# EAGLE design baseboard (EAGLE 6.4)
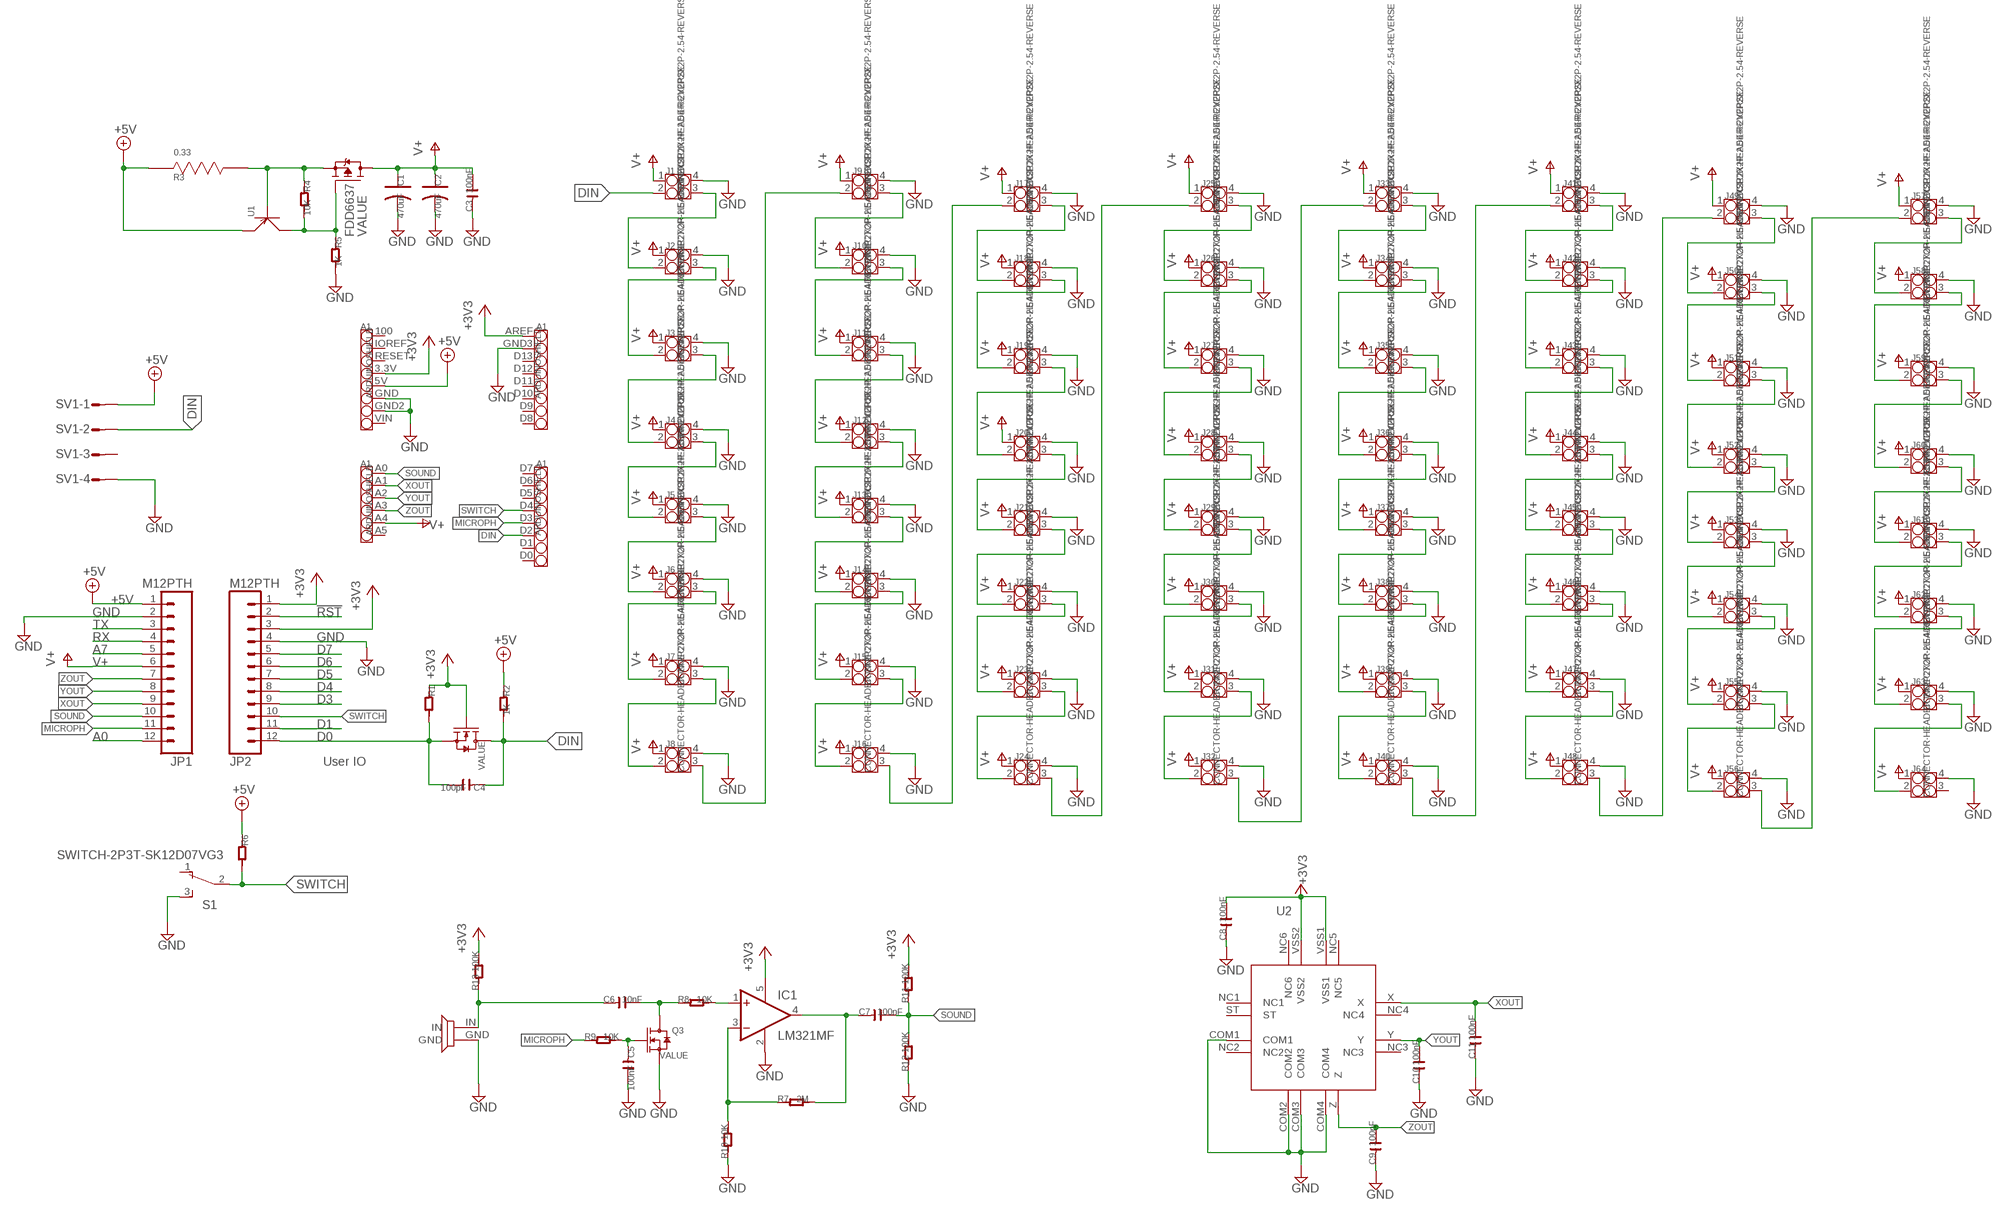
[diagram p0: schematic, sheet 1]

## Parts
2N7002  MOSFET-N-044020001  [SOT23]
A1  ARDUINOSHIELD  [ARDUINOSHIELD]
C1  470uF  C-POLARCAPACITOR-E5-8.5  [CAPACITOR-E5-8.5]
C2  470uF  C-POLARCAPACITOR-E5-8.5  [CAPACITOR-E5-8.5]
C3  100nF  C-0603  [C0603]
C4  100pF  C-0603  [C0603]
C5  100nF  C-0603  [C0603]
C6  10nF  C-0603  [C0603]
C7  100nF  C-0603  [C0603]
C8  100nF  C-0603  [C0603]
C9  100nF  C-0603  [C0603]
C10  100nF  C-0603  [C0603]
C11  100nF  C-0603  [C0603]
FDD6637  FDD4141TO252  [TO252]
IC1  LM321MF  [SOT23-5]
J1  CONNECTOR-HEADER-2X2P2X2P-2.54-REVERSE  [2X2P-2.54-REVERSE]
J2  CONNECTOR-HEADER-2X2P2X2P-2.54-REVERSE  [2X2P-2.54-REVERSE]
J3  CONNECTOR-HEADER-2X2P2X2P-2.54-REVERSE  [2X2P-2.54-REVERSE]
J4  CONNECTOR-HEADER-2X2P2X2P-2.54-REVERSE  [2X2P-2.54-REVERSE]
J5  CONNECTOR-HEADER-2X2P2X2P-2.54-REVERSE  [2X2P-2.54-REVERSE]
J6  CONNECTOR-HEADER-2X2P2X2P-2.54-REVERSE  [2X2P-2.54-REVERSE]
J7  CONNECTOR-HEADER-2X2P2X2P-2.54-REVERSE  [2X2P-2.54-REVERSE]
J8  CONNECTOR-HEADER-2X2P2X2P-2.54-REVERSE  [2X2P-2.54-REVERSE]
J9  CONNECTOR-HEADER-2X2P2X2P-2.54-REVERSE  [2X2P-2.54-REVERSE]
J10  CONNECTOR-HEADER-2X2P2X2P-2.54-REVERSE  [2X2P-2.54-REVERSE]
J11  CONNECTOR-HEADER-2X2P2X2P-2.54-REVERSE  [2X2P-2.54-REVERSE]
J12  CONNECTOR-HEADER-2X2P2X2P-2.54-REVERSE  [2X2P-2.54-REVERSE]
J13  CONNECTOR-HEADER-2X2P2X2P-2.54-REVERSE  [2X2P-2.54-REVERSE]
J14  CONNECTOR-HEADER-2X2P2X2P-2.54-REVERSE  [2X2P-2.54-REVERSE]
J15  CONNECTOR-HEADER-2X2P2X2P-2.54-REVERSE  [2X2P-2.54-REVERSE]
J16  CONNECTOR-HEADER-2X2P2X2P-2.54-REVERSE  [2X2P-2.54-REVERSE]
J17  CONNECTOR-HEADER-2X2P2X2P-2.54-REVERSE  [2X2P-2.54-REVERSE]
J18  CONNECTOR-HEADER-2X2P2X2P-2.54-REVERSE  [2X2P-2.54-REVERSE]
J19  CONNECTOR-HEADER-2X2P2X2P-2.54-REVERSE  [2X2P-2.54-REVERSE]
J20  CONNECTOR-HEADER-2X2P2X2P-2.54-REVERSE  [2X2P-2.54-REVERSE]
J21  CONNECTOR-HEADER-2X2P2X2P-2.54-REVERSE  [2X2P-2.54-REVERSE]
J22  CONNECTOR-HEADER-2X2P2X2P-2.54-REVERSE  [2X2P-2.54-REVERSE]
J23  CONNECTOR-HEADER-2X2P2X2P-2.54-REVERSE  [2X2P-2.54-REVERSE]
J24  CONNECTOR-HEADER-2X2P2X2P-2.54-REVERSE  [2X2P-2.54-REVERSE]
J25  CONNECTOR-HEADER-2X2P2X2P-2.54-REVERSE  [2X2P-2.54-REVERSE]
J26  CONNECTOR-HEADER-2X2P2X2P-2.54-REVERSE  [2X2P-2.54-REVERSE]
J27  CONNECTOR-HEADER-2X2P2X2P-2.54-REVERSE  [2X2P-2.54-REVERSE]
J28  CONNECTOR-HEADER-2X2P2X2P-2.54-REVERSE  [2X2P-2.54-REVERSE]
J29  CONNECTOR-HEADER-2X2P2X2P-2.54-REVERSE  [2X2P-2.54-REVERSE]
J30  CONNECTOR-HEADER-2X2P2X2P-2.54-REVERSE  [2X2P-2.54-REVERSE]
J31  CONNECTOR-HEADER-2X2P2X2P-2.54-REVERSE  [2X2P-2.54-REVERSE]
J32  CONNECTOR-HEADER-2X2P2X2P-2.54-REVERSE  [2X2P-2.54-REVERSE]
J33  CONNECTOR-HEADER-2X2P2X2P-2.54-REVERSE  [2X2P-2.54-REVERSE]
J34  CONNECTOR-HEADER-2X2P2X2P-2.54-REVERSE  [2X2P-2.54-REVERSE]
J35  CONNECTOR-HEADER-2X2P2X2P-2.54-REVERSE  [2X2P-2.54-REVERSE]
J36  CONNECTOR-HEADER-2X2P2X2P-2.54-REVERSE  [2X2P-2.54-REVERSE]
J37  CONNECTOR-HEADER-2X2P2X2P-2.54-REVERSE  [2X2P-2.54-REVERSE]
J38  CONNECTOR-HEADER-2X2P2X2P-2.54-REVERSE  [2X2P-2.54-REVERSE]
J39  CONNECTOR-HEADER-2X2P2X2P-2.54-REVERSE  [2X2P-2.54-REVERSE]
J40  CONNECTOR-HEADER-2X2P2X2P-2.54-REVERSE  [2X2P-2.54-REVERSE]
J41  CONNECTOR-HEADER-2X2P2X2P-2.54-REVERSE  [2X2P-2.54-REVERSE]
J42  CONNECTOR-HEADER-2X2P2X2P-2.54-REVERSE  [2X2P-2.54-REVERSE]
J43  CONNECTOR-HEADER-2X2P2X2P-2.54-REVERSE  [2X2P-2.54-REVERSE]
J44  CONNECTOR-HEADER-2X2P2X2P-2.54-REVERSE  [2X2P-2.54-REVERSE]
J45  CONNECTOR-HEADER-2X2P2X2P-2.54-REVERSE  [2X2P-2.54-REVERSE]
J46  CONNECTOR-HEADER-2X2P2X2P-2.54-REVERSE  [2X2P-2.54-REVERSE]
J47  CONNECTOR-HEADER-2X2P2X2P-2.54-REVERSE  [2X2P-2.54-REVERSE]
J48  CONNECTOR-HEADER-2X2P2X2P-2.54-REVERSE  [2X2P-2.54-REVERSE]
J49  CONNECTOR-HEADER-2X2P2X2P-2.54-REVERSE  [2X2P-2.54-REVERSE]
J50  CONNECTOR-HEADER-2X2P2X2P-2.54-REVERSE  [2X2P-2.54-REVERSE]
J51  CONNECTOR-HEADER-2X2P2X2P-2.54-REVERSE  [2X2P-2.54-REVERSE]
J52  CONNECTOR-HEADER-2X2P2X2P-2.54-REVERSE  [2X2P-2.54-REVERSE]
J53  CONNECTOR-HEADER-2X2P2X2P-2.54-REVERSE  [2X2P-2.54-REVERSE]
J54  CONNECTOR-HEADER-2X2P2X2P-2.54-REVERSE  [2X2P-2.54-REVERSE]
J55  CONNECTOR-HEADER-2X2P2X2P-2.54-REVERSE  [2X2P-2.54-REVERSE]
J56  CONNECTOR-HEADER-2X2P2X2P-2.54-REVERSE  [2X2P-2.54-REVERSE]
J57  CONNECTOR-HEADER-2X2P2X2P-2.54-REVERSE  [2X2P-2.54-REVERSE]
J58  CONNECTOR-HEADER-2X2P2X2P-2.54-REVERSE  [2X2P-2.54-REVERSE]
J59  CONNECTOR-HEADER-2X2P2X2P-2.54-REVERSE  [2X2P-2.54-REVERSE]
J60  CONNECTOR-HEADER-2X2P2X2P-2.54-REVERSE  [2X2P-2.54-REVERSE]
J61  CONNECTOR-HEADER-2X2P2X2P-2.54-REVERSE  [2X2P-2.54-REVERSE]
J62  CONNECTOR-HEADER-2X2P2X2P-2.54-REVERSE  [2X2P-2.54-REVERSE]
J63  CONNECTOR-HEADER-2X2P2X2P-2.54-REVERSE  [2X2P-2.54-REVERSE]
J64  CONNECTOR-HEADER-2X2P2X2P-2.54-REVERSE  [2X2P-2.54-REVERSE]
JP1  M12PTH  [1X12-SMALL-PADS]
JP2  M12PTH  [1X12-SMALL-PADS]
Q3  MOSFET-N-044020001  [SOT23]
R1  R-0603  [R0603]
R2  1K  R-0603  [R0603]
R3  0.33  RESISTOR-3W-20MM  [RESISTOR-3W-20MM]
R4  10K  R-0603  [R0603]
R5  1K  R-0603  [R0603]
R6  R-0603  [R0603]
R7  2M  R-0603  [R0603]
R8  10K  R-0603  [R0603]
R9  10K  R-0603  [R0603]
R10  10K  R-0603  [R0603]
R11  100K  R-0603  [R0603]
R12  100K  R-0603  [R0603]
R13  100K  R-0603  [R0603]
S1  SWITCH-2P3T-SK12D07VG3  [SWITCH-2P3T-SK12D07VG3]
SV1  S04P  [S04P]
U1  TRANSISTOR-PNP-041003001  [SOT23]
U2  ADXL335  [ADXL335]
U$1  MICROPHONE  [MICROPHONE]

## Nets
!RST: JP2.2
+3V3: 2N7002.1(G) A1.3.3V A1.AREF C8.2 IC1.5(V+) JP2.1 JP2.3 R1.1 R11.2 R13.2 U2.VSS1 U2.VSS2
+5V: A1.5V JP1.1 R2.1 R3.1 R6.1 SV1.1 U1.2(E)
A0: JP1.12
A7: JP1.5
D0: 2N7002.2(S) C4.2 JP2.12 R1.2
D1: JP2.11
D3: JP2.9
D4: JP2.8
D5: JP2.7
D6: JP2.6
D7: JP2.5
DIN: 2N7002.3(D) A1.D2 C4.1 J1.2 R2.2 SV1.2
GND: A1.GND A1.GND2 A1.GND3 C1.- C2.- C3.1 C5.2 C8.1 C9.1 C10.1 C11.1 IC1.2(V-) J1.4 J2.4 J3.4 J4.4 J5.4 J6.4 J7.4 J8.4 J9.4 J10.4 J11.4 J12.4 J13.4 J14.4 J15.4 J16.4 J17.4 J18.4 J19.4 J20.4 J21.4 J22.4 J23.4 J24.4 J25.4 J26.4 J27.4 J28.4 J29.4 J30.4 J31.4 J32.4 J33.4 J34.4 J35.4 J36.4 J37.4 J38.4 J39.4 J40.4 J41.4 J42.4 J43.4 J44.4 J45.4 J46.4 J47.4 J48.4 J49.4 J50.4 J51.4 J52.4 J53.4 J54.4 J55.4 J56.4 J57.4 J58.4 J59.4 J60.4 J61.4 J62.4 J63.4 J64.4 JP1.2 JP2.4 Q3.2(S) R5.2 R10.1 R12.1 S1.3(S) SV1.4 U2.COM1 U2.COM2 U2.COM3 U2.COM4 U$1.GND
MICROPH: A1.D3 JP1.11 R9.1
N$1: J1.3 J2.2
N$2: J2.3 J3.2
N$3: J3.3 J4.2
N$4: J5.3 J6.2
N$5: J6.3 J7.2
N$6: J7.3 J8.2
N$7: J4.3 J5.2
N$8: J9.3 J10.2
N$9: J10.3 J11.2
N$10: J11.3 J12.2
N$11: J13.3 J14.2
N$12: J14.3 J15.2
N$13: J15.3 J16.2
N$14: J12.3 J13.2
N$15: J17.3 J18.2
N$16: J18.3 J19.2
N$17: J19.3 J20.2
N$18: J21.3 J22.2
N$19: J22.3 J23.2
N$20: J23.3 J24.2
N$21: J20.3 J21.2
N$22: J25.3 J26.2
N$23: J26.3 J27.2
N$24: J27.3 J28.2
N$25: J29.3 J30.2
N$26: J30.3 J31.2
N$27: J31.3 J32.2
N$28: J28.3 J29.2
N$29: J8.3 J9.2
N$30: J16.3 J17.2
N$31: J24.3 J25.2
N$32: C7.1 IC1.4(OUT) R7.2
N$33: J33.3 J34.2
N$34: J34.3 J35.2
N$35: J35.3 J36.2
N$36: J37.3 J38.2
N$37: J38.3 J39.2
N$38: J39.3 J40.2
N$39: J36.3 J37.2
N$40: J41.3 J42.2
N$41: J42.3 J43.2
N$42: J43.3 J44.2
N$43: J45.3 J46.2
N$44: J46.3 J47.2
N$45: J47.3 J48.2
N$46: J44.3 J45.2
N$47: J49.3 J50.2
N$48: J50.3 J51.2
N$49: J51.3 J52.2
N$50: J53.3 J54.2
N$51: J54.3 J55.2
N$52: J55.3 J56.2
N$53: J52.3 J53.2
N$54: J57.3 J58.2
N$55: J58.3 J59.2
N$56: J59.3 J60.2
N$57: J61.3 J62.2
N$58: J62.3 J63.2
N$59: J63.3 J64.2
N$60: J60.3 J61.2
N$61: J40.3 J41.2
N$62: J48.3 J49.2
N$63: J56.3 J57.2
N$64: J32.3 J33.2
N$65: FDD6637.2(S) R3.2 R4.1 U1.1(B)
N$66: IC1.3(-IN) R7.1 R10.2
N$67: FDD6637.1(G) R4.2 R5.1 U1.3(C)
N$68: C5.1 Q3.1(G) R9.2
N$69: IC1.1(+IN) R8.2
N$70: C6.2 Q3.3(D) R8.1
N$72: C6.1 R13.1 U$1.IN
RX: JP1.4
SOUND: A1.A0 C7.2 JP1.10 R11.1 R12.2
SWITCH: A1.D4 JP2.10 R6.2 S1.2(P)
TX: JP1.3
V+: A1.A4 C1.+ C2.+ C3.2 FDD6637.3(D) J1.1 J2.1 J3.1 J4.1 J5.1 J6.1 J7.1 J8.1 J9.1 J10.1 J11.1 J12.1 J13.1 J14.1 J15.1 J16.1 J17.1 J18.1 J19.1 J20.1 J21.1 J22.1 J23.1 J24.1 J25.1 J26.1 J27.1 J28.1 J29.1 J30.1 J31.1 J32.1 J33.1 J34.1 J35.1 J36.1 J37.1 J38.1 J39.1 J40.1 J41.1 J42.1 J43.1 J44.1 J45.1 J46.1 J47.1 J48.1 J49.1 J50.1 J51.1 J52.1 J53.1 J54.1 J55.1 J56.1 J57.1 J58.1 J59.1 J60.1 J61.1 J62.1 J63.1 J64.1 JP1.6
XOUT: A1.A1 C11.2 JP1.9 U2.X
YOUT: A1.A2 C10.2 JP1.8 U2.Y
ZOUT: A1.A3 C9.2 JP1.7 U2.Z
Unconnected: A1.100 A1.A5 A1.D0 A1.D1 A1.D5 A1.D6 A1.D7 A1.D8 A1.D9 A1.D10 A1.D11 A1.D12 A1.D13 A1.IOREF A1.RESET A1.VIN J64.3 S1.1(O) SV1.3 U2.NC1 U2.NC2 U2.NC3 U2.NC4 U2.NC5 U2.NC6 U2.ST

## Notes on the sheet
- User IO

## Library data of the parts
2N7002 Q3 = OPL Eagle Library:MOSFET-N: CJ2302：SMD MOSFET N-CH 20V-2.1A
A1 = OPL Eagle Library:ARDUINOSHIELD
C1 C2 = OPL Eagle Library:C-POLAR*
C3-C11 = OPL Eagle Library:C*
FDD6637 = transistor-fet:FDD4141: P-Channel PowerTrench® MOSFET Source: FDD4141.pdf
IC1 = linear:LM321?*: Low Power Single Op Amp Source: http://cache.national.com/ds/LM/LM321.pdf
J1-J64 = OPL Eagle Library:CONNECTOR-HEADER-2X2P
JP1 JP2 = Spark:M12: Header 12 Standard 12-pin 0.1" header. Use with straight break away headers (SKU : PRT-00116), right angle break away headers (PRT-00553), swiss pins (PRT-00743), machine pins (PRT-00117), and female headers (PRT-00115).
R1 R2 R4-R13 = OPL Eagle Library:R*
R3 = OPL Eagle Library:RESISTOR-3W-20MM
S1 = OPL Eagle Library:SWITCH-2P3T-SK12D07VG3: TINY SWITCH ON - ON Source: http://www2.produktinfo.conrad.com/datenblaetter/700000-724999/705152-da-01-de-Subminiaturschalter_TL_36YO.pdf
SV1 = con-amp-mt:S04P: AMP MT CONNECTOR; OC_FARNELL: unknown; OC_NEWARK: unknown
U1 = OPL Eagle Library:TRANSISTOR-PNP*: S8550：PNP Transistor
U2 = OPL Eagle Library:ADXL335
U$1 = OPL Eagle Library:MICROPHONE

## Board
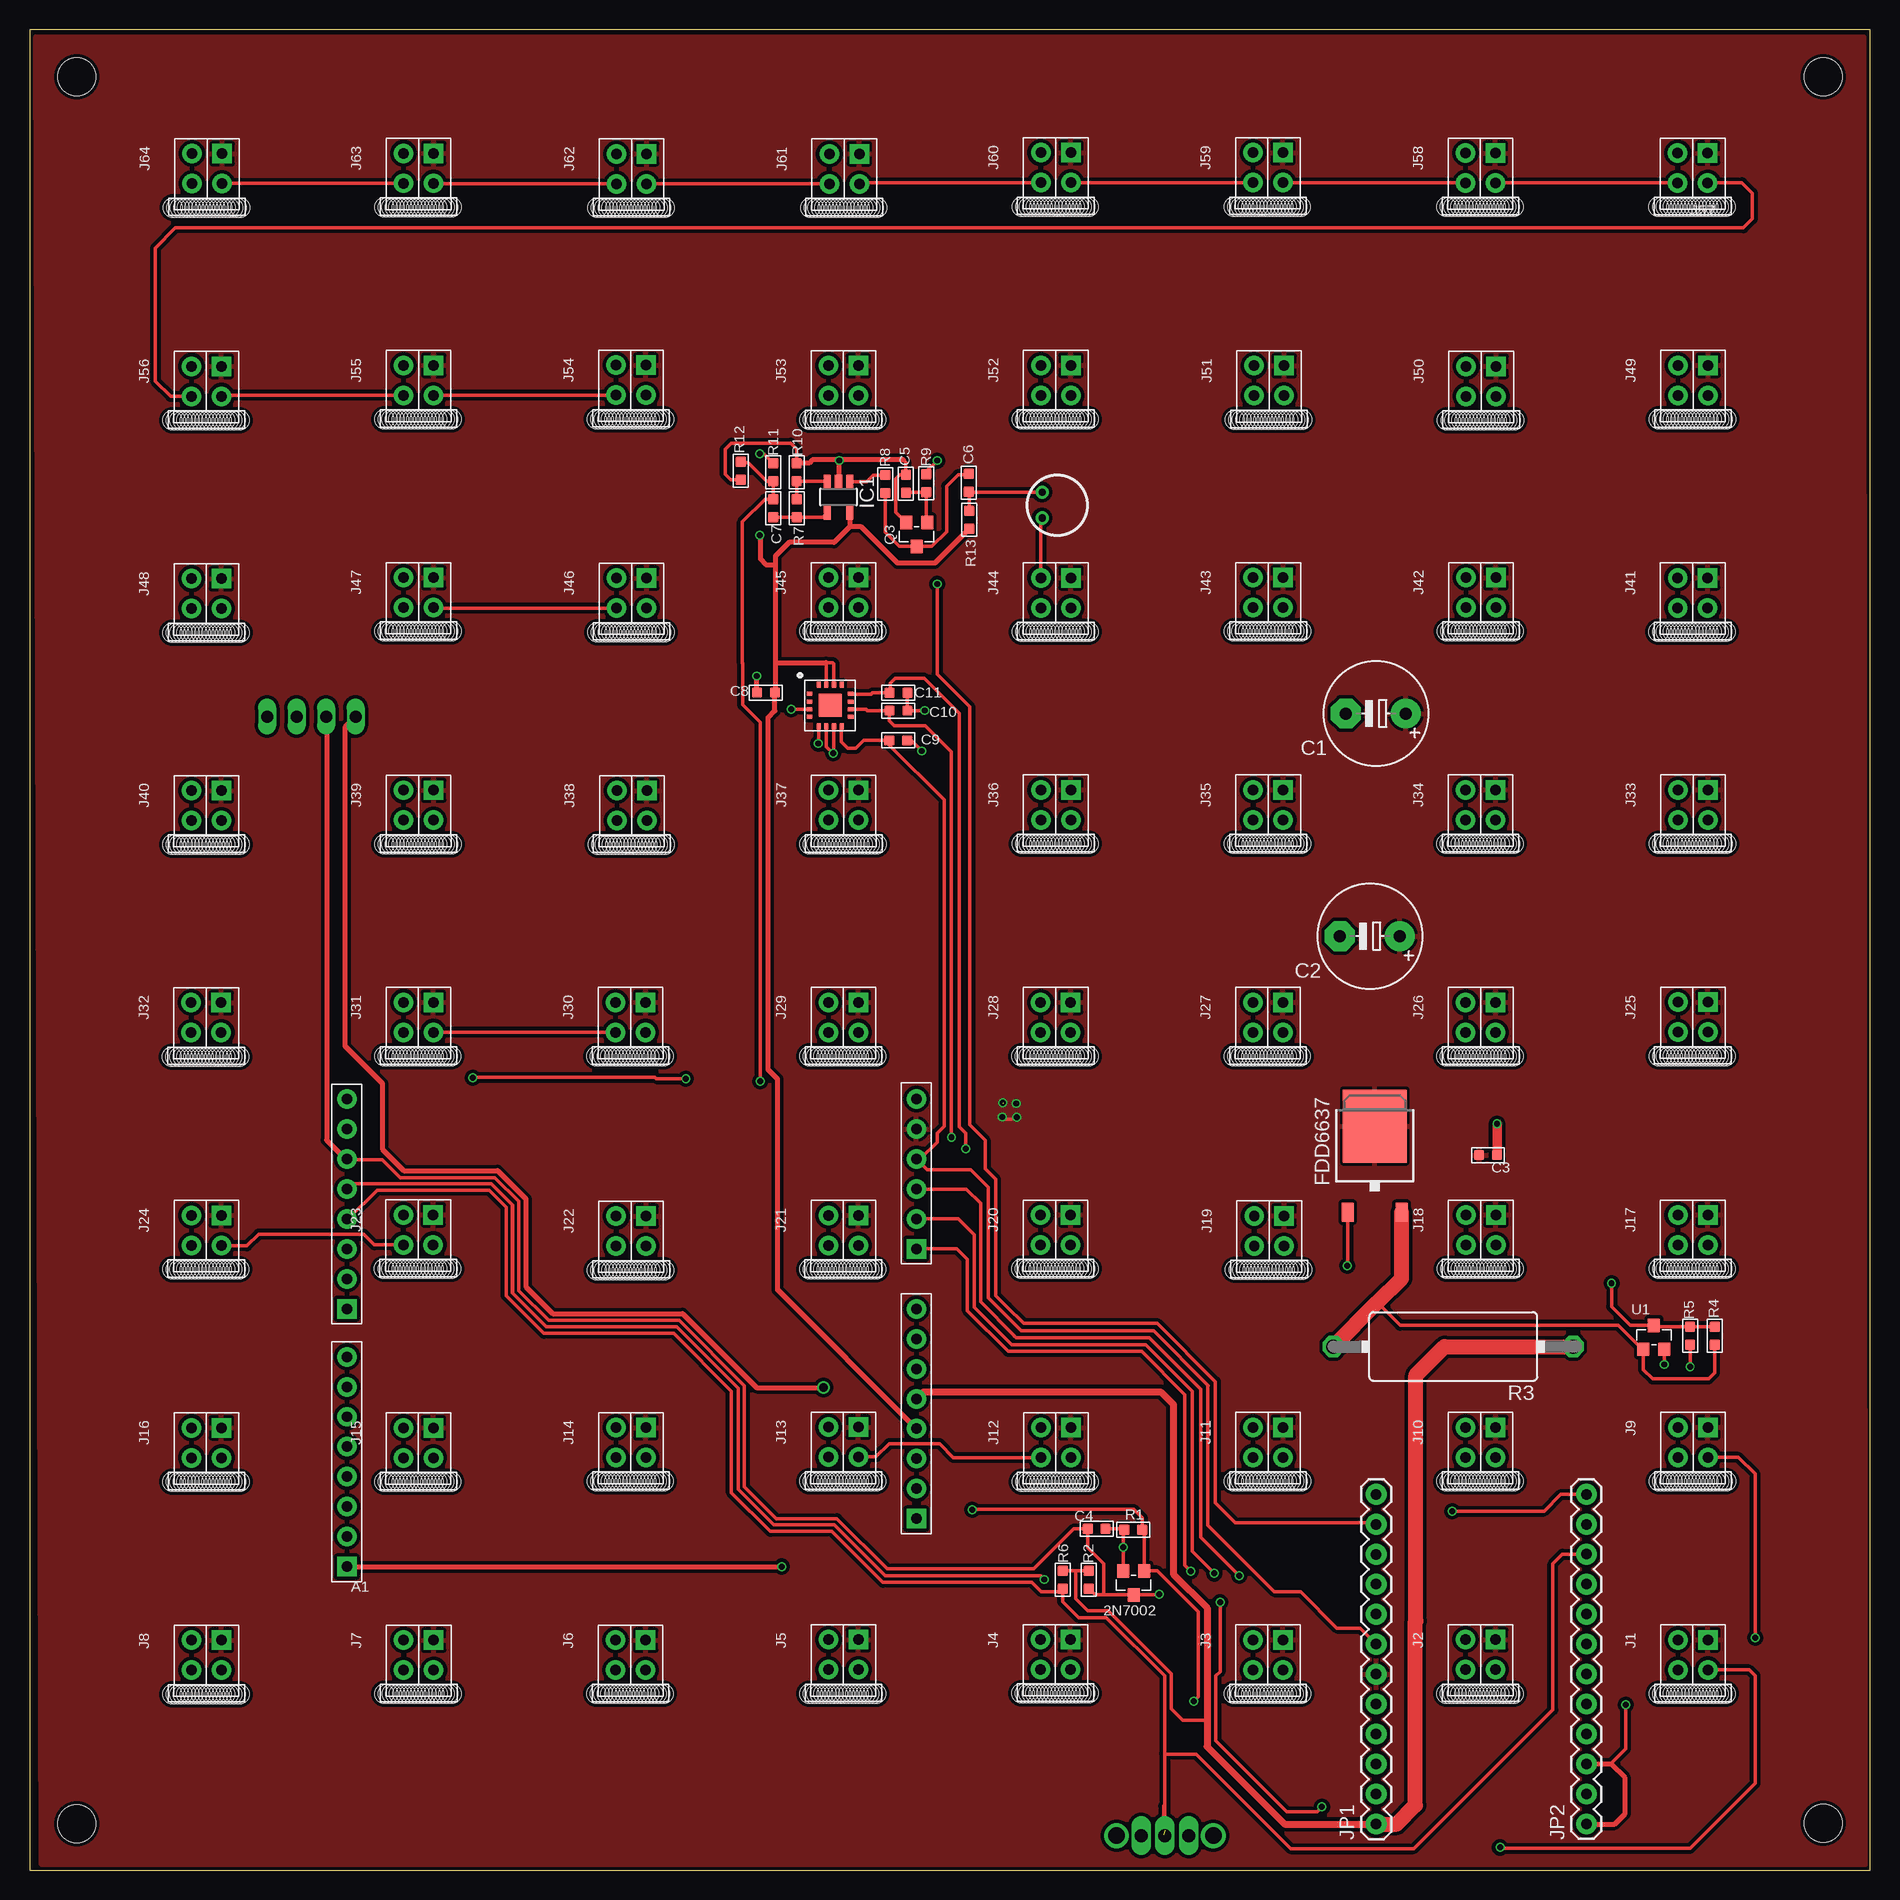
[diagram p1: board, top side]
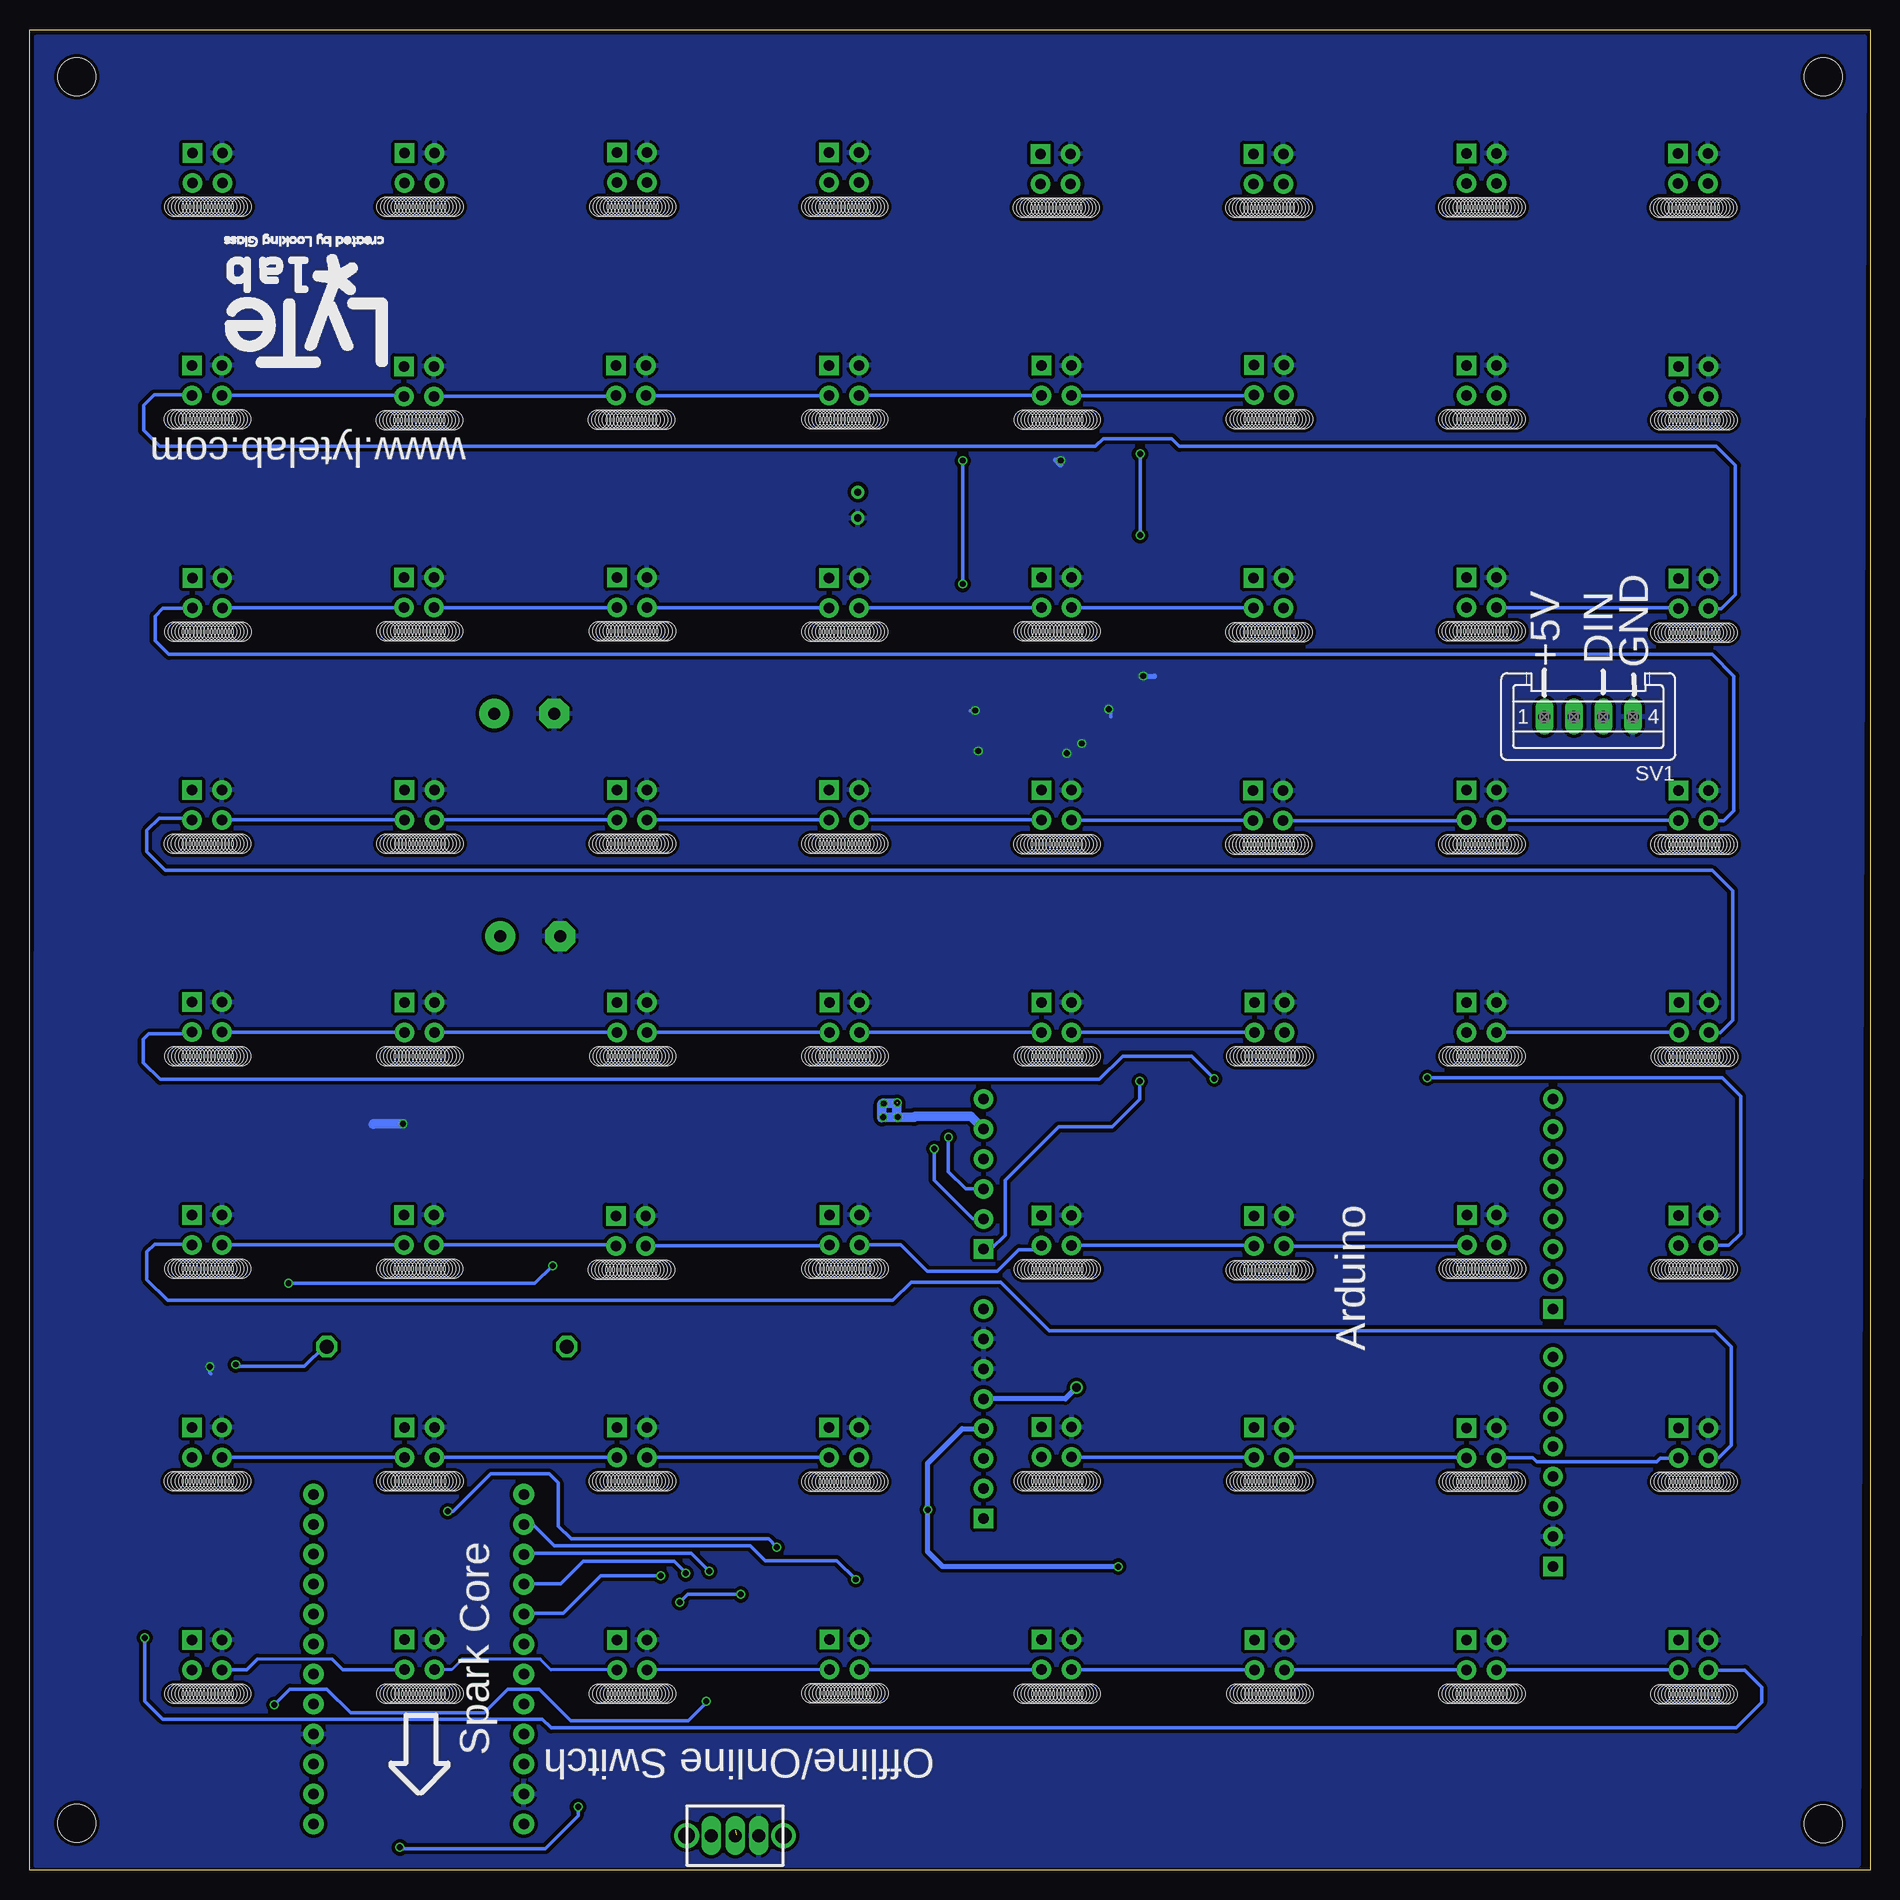
[diagram p2: board, bottom side, seen from below]

Size 156.01 x 156.01 mm. Coordinates in mm from the lower left corner, seen from the top.
Outline: 156.01,156.01 0,156.01 0,0 156.01,0 156.01,156.01
Copper layers (1*16): Top 0.035mm / dielectric 0.5mm / Bottom 0.035mm
Design rules "default *": minimum track width 10mil, minimum drill 15mil, track to track 8mil, track to pad 0mil, pad to pad 0mil, via to via 0mil, smd to smd 8mil, copper to edge 0mil, drill to drill 0mil, minimum pad ring 10mil, minimum via ring 0mil, stop-mask expansion 4mil, vias tented up to drill 0mil, thermal gap 10mil
Holes 3.2 mm at 3.99,151.99 152.02,151.99 152.02,3.99 3.99,3.96

### Footprints (pad centres in the part's own frame; a part is rotated, then mirrored left to right if it is on the bottom)
SOT23 = smd 1.016 x 1.143: 1 -0.889,-1.016; 2 0.889,-1.016; 3 0,1.016
ARDUINOSHIELD = drill 0.889 pad 1.651: 3.3V 35.56,2.54; 5V 38.1,2.54; A1 53.34,2.54; A2 55.88,2.54; A3 58.42,2.54; A4 60.96,2.54; A5 63.5,2.54; D0 63.5,50.8; D1 60.96,50.8; D2 58.42,50.8; D3 55.88,50.8; D4 53.34,50.8; D5 50.8,50.8; D6 48.26,50.8; D8 41.656,50.8; D9 39.116,50.8; D10 36.576,50.8; D11 34.036,50.8; D12 31.496,50.8; D13 28.956,50.8; GND 40.64,2.54; GND2 43.18,2.54; GND3 26.416,50.8; IOREF 30.48,2.54; RESET 33.02,2.54; VIN 45.72,2.54 | drill 0.889 pad 1.651 square: 100 27.94,2.54; A0 50.8,2.54; AREF 23.876,50.8; D7 45.72,50.8
CAPACITOR-E5-8.5 = drill 1.016 pad 2.54: + -2.54,0 | drill 1.016 pad 2.54 octagon: - 2.54,0
C0603 = smd 0.889 x 0.889: 1 -0.762,0; 2 0.762,0
TO252 = smd 1 x 1.6: 1 -2.28,-4.8; 2 2.28,-4.8 | smd 5.4 x 6.2: 3 0,2.5
SOT23-5 = smd 0.6 x 1.2: 1 -0.95,-1.306; 2 0,-1.306; 3 0.95,-1.306; 4 0.95,1.306; 5 -0.95,1.306
2X2P-2.54-REVERSE = drill 0.889 pad 1.651 square: 1 -1.27,-1.27 | drill 0.889 pad 1.651: 2 -1.27,1.27; 3 1.27,1.27; 4 1.27,-1.27 | hole 1.6: -2.8,3.3; -2.5,3.3; -2.2,3.3; -1.9,3.3; -1.6,3.3; -1.3,3.3; -1,3.3; -0.7,3.3; -0.4,3.3; -0.1,3.3; 0.2,3.3; 0.5,3.3; 0.8,3.3; 1.1,3.3; 1.4,3.3; 1.7,3.3; 2,3.3; 2.3,3.3; 2.6,3.3; 2.9,3.3
1X12-SMALL-PADS = drill 0.889 pad 1.753: 1 0,0; 2 2.54,0; 3 5.08,0; 4 7.62,0; 5 10.16,0; 6 12.7,0; 7 15.24,0; 8 17.78,0; 9 20.32,0; 10 22.86,0; 11 25.4,0; 12 27.94,0
R0603 = smd 0.889 x 0.889: 1 -0.762,0; 2 0.762,0
RESISTOR-3W-20MM = drill 1.194 octagon: 1 -10.16,0; 2 10.16,0
SWITCH-2P3T-SK12D07VG3 = drill 1.1 pad 1.422 long: 1 -2,0; 2 0,0; 3 2,0 | drill 1.4 pad 1.93: M1 -4.1,0; M2 4.1,0
S04P = drill 1.016 long: 1 3.75,0; 2 1.25,0; 3 -1.25,0; 4 -3.75,0
ADXL335 = smd 0.5 x 0.35: COM1 -1.75,-0.325; NC1 -1.75,0.975; NC2 -1.75,-0.975; NC3 1.75,-0.975; NC4 1.75,0.325; ST -1.75,0.325; X 1.75,0.975; Y 1.75,-0.325 | smd 0.35 x 0.5: COM2 -0.975,-1.75; COM3 -0.325,-1.75; COM4 0.325,-1.75; NC5 0.975,1.75; NC6 -0.975,1.75; VSS1 0.325,1.75; VSS2 -0.325,1.75; Z 0.975,-1.75 | smd 1.95 x 1.95: P$17 0,0
MICROPHONE = drill 0.6: GND 0,-1.1; IN 0,1.1

### Placement (x,y rotation side)
2N7002  93.56,24.37 180 top
A1  77.7,1.87 90 top
C1  114.1,98.04 180 top
C2  113.59,79.17 180 top
C3  123.59,60.63 180 top
C4  90.42,28.96 0 top
C5  74.27,117.52 90 top
C6  79.58,117.59 90 top
C7  63.03,115.43 90 top
C8  62.41,99.82 0 top
C9  73.61,95.76 180 top
C10  73.63,98.3 180 top
C11  73.63,99.8 180 top
FDD6637  114,60.58 0 top
IC1  68.55,116.38 180 top
J1  140.96,18.28 180 top
J2  122.96,18.29 180 top
J3  104.95,18.27 180 top
J4  86.94,18.3 180 top
J5  68.97,18.29 180 top
J6  50.94,18.26 180 top
J7  32.98,18.26 180 top
J8  14.99,18.25 180 top
J9  140.97,36.28 180 top
J10  122.96,36.28 180 top
J11  104.95,36.28 180 top
J12  86.97,36.26 180 top
J13  68.97,36.29 180 top
J14  50.96,36.27 180 top
J15  32.95,36.24 180 top
J16  15,36.24 180 top
J17  140.95,54.28 180 top
J18  122.99,54.28 180 top
J19  105.06,54.2 180 top
J20  86.95,54.28 180 top
J21  68.97,54.25 180 top
J22  50.98,54.18 180 top
J23  32.94,54.29 180 top
J24  14.99,54.24 180 top
J25  140.95,72.31 180 top
J26  122.97,72.29 180 top
J27  104.94,72.29 180 top
J28  86.96,72.29 180 top
J29  68.97,72.3 180 top
J30  50.94,72.3 180 top
J31  32.95,72.3 180 top
J32  14.97,72.27 180 top
J33  140.97,90.3 180 top
J34  122.97,90.3 180 top
J35  104.97,90.3 180 top
J36  86.97,90.3 180 top
J37  68.99,90.27 180 top
J38  51.04,90.25 180 top
J39  32.97,90.27 180 top
J40  14.99,90.25 180 top
J41  140.94,108.27 180 top
J42  122.99,108.3 180 top
J43  104.97,108.3 180 top
J44  86.97,108.27 180 top
J45  68.97,108.3 180 top
J46  51.02,108.25 180 top
J47  32.97,108.3 180 top
J48  14.99,108.19 180 top
J49  140.97,126.27 180 top
J50  123.02,126.19 180 top
J51  105.04,126.25 180 top
J52  86.97,126.27 180 top
J53  68.97,126.25 180 top
J54  50.97,126.3 180 top
J55  32.97,126.27 180 top
J56  14.99,126.19 180 top
J57  140.94,144.27 180 top
J58  122.95,144.27 180 top
J59  104.94,144.3 180 top
J60  86.97,144.3 180 top
J61  69.04,144.19 180 top
J62  51.02,144.19 180 top
J63  32.97,144.25 180 top
J64  15.04,144.22 180 top
JP1  114.12,3.94 90 top
JP2  131.94,3.94 90 top
Q3  75.17,113.21 180 top
R1  93.54,28.89 180 top
R2  89.76,24.65 270 top
R3  120.65,44.4 180 top
R4  142.8,45.31 90 top
R5  140.72,45.31 270 top
R6  87.55,24.64 270 top
R7  65.01,115.45 270 top
R8  72.51,117.49 90 top
R9  76,117.56 270 top
R10  65,118.47 270 top
R11  63.03,118.48 90 top
R12  60.26,118.61 90 top
R13  79.63,114.46 270 top
S1  96.22,2.95 0 bottom
SV1  23.88,97.78 180 bottom
U1  137.64,45.19 0 top
U2  67.84,98.73 0 top
U$1  85.81,115.71 0 top

### Tracks (layer width: path | path; a pad name or v marks a point on that pad's centre or on a via)
+3V3  (via drill 0.5, 0.51)
  Top 0.305: C8.2 63.2,99.85 | U2.VSS1 68.17,102.27 68.07,102.36 67.51,102.36 U2.VSS2 | IC1.5 69.49,115.07 | R11.2 62.23,120.04 v61.9,120.04 | v61.9,113.16 61.92,113.13 | A1.3.3V 75.38,37.21 | v79.9,30.58 79.92,30.61 93.57,30.61 94.3,29.88 R1.1 94.45,28.74 2N7002.1 95.57,25.39 99.03,21.92 99.03,14.73 v98.65,14.35 | JP2.3 132.01,9.09 134.04,9.09 135.25,10.31 v135.25,14.05
  Top 0.406: 63.2,102.36 67.51,102.36 | 69.49,115.07 69.49,113.87 | 69.49,113.87 68.17,112.55 64.36,112.55 63.2,111.38 63.2,110.67 | 63.2,110.67 63.2,102.36 | 63.2,102.36 63.2,99.85 | 61.92,113.13 61.92,111.15 62.41,110.67 63.2,110.67 | R13.2 76.73,110.8 73.56,110.8 70.48,113.87 69.49,113.87 | A1.3.3V 63.4,49.2 63.4,67.06 62.59,67.87 62.59,97.69 63.17,98.27 C8.2 | JP2.1 134.31,3.94 135.2,4.83 135.2,7.85 134.03,9.02 JP2.3 | A1.AREF v63.75,25.76
  Bottom 0.305: v61.9,120.04 v61.9,113.16 | v135.25,14.05 133.93,15.37 130.81,15.37 128.8,13.36 117.47,13.36 115.47,15.37 112.83,15.37 110.13,12.68 100.18,12.68 98.65,14.2 v98.65,14.35
  Bottom 0.406: v63.75,25.76 78.64,25.76 79.9,27.01 v79.9,30.58 79.9,34.51 76.97,37.44 A1.3.3V
+5V  (via drill 0.5, 0.7)
  Top 0.305: R6.1 88.67,25.4 | R2.1 89.75,25.4 88.67,25.4 | 88.67,25.4 88.67,23.04 89.69,22.02 91.42,22.02 96.75,16.69 96.75,13.69 97.71,12.72 99.8,12.72 | U1.2 v138.53,42.88
  Top 0.406: SV1.1 26.72,96.87 26.72,69.88 29.9,66.7 29.9,61.14 31.73,59.31 39.67,59.31 42.06,56.92 42.06,49.48 44.35,47.19 55.35,47.19 61.62,40.92 v67.28,40.92
  Top 0.61: A1.5V 75.75,40.56 95.86,40.56 96.93,39.5 96.93,25.12 99.8,22.25 99.8,12.72 99.8,10.49 106.35,3.94 114.68,3.94
  Top 1.016: JP1.1
  Top 1.27: JP1.1 114.68,3.94 115.88,3.94 117.45,5.51 117.45,21.13 117.47,21.16 117.47,41.99 119.89,44.4 R3.1
  Bottom 0.305: v138.53,42.88 138.38,42.72 132.72,42.72 131.04,44.4 R3.1
  Bottom 0.406: v67.28,40.92 68.23,39.98 A1.5V
D0  (via drill 0.5, 0.51)
  Top 0.305: 2N7002.2 v92.67,27.38 92.67,28.79 R1.2 92.71,28.96 C4.2 | v120.57,30.45 128.35,30.45 129.77,31.88 JP2.12
  Bottom 0.305: v92.67,27.38 93.38,28.09 110.11,28.09 111.2,29.18 111.2,32.84 111.96,33.6 116.94,33.6 120.09,30.45 v120.57,30.45
DIN  (via drill 0.51)
  Top 0.305: 90.88,23.36 2N7002.3 95.69,23.36 v95.73,23.39 | 90.88,23.36 90.29,23.36 R2.2 | 90.88,23.36 91.03,23.51 91.03,25.98 89.69,27.33 89.69,28.93 C4.1 88.49,28.96 85.11,25.58 72.67,25.58 68.43,29.82 63.3,29.82 60.58,32.54 60.58,41.1 55.07,46.61 44.02,46.61 41.48,49.15 41.48,56.69 39.45,58.73 31.42,58.73 29.9,60.25 26.95,60.25 A1.D2 | v124.61,1.96 124.69,1.88 140.72,1.88 146.23,7.39 146.23,16.51 145.73,17.01 J1.2 142.19,16.97 | v100.89,22.73 100.89,16.84 100.53,16.48 100.53,11 106.55,4.98 109.12,4.98 v109.53,5.38
  Top 0.406: SV1.2 25.17,97.74 25.17,61.9 26.78,60.3 A1.D2
  Bottom 0.305: v124.61,1.96 124.51,1.85 112.29,1.85 109.53,4.62 v109.53,5.38 | v95.73,23.39 100.23,23.39 v100.89,22.73
GND  (via drill 0.5)
  Top 0.305: 68.63,117.77 IC1.2 | R12.1 59.45,117.85 58.95,118.34 58.95,120.42 59.49,120.95 64.49,120.95 65,120.45 R10.1 65.3,119.53 | 74.07,119.53 74.27,119.33 C5.2 73.75,118.28 73.41,117.93 73.41,115.1 Q3.2 | 68.63,119.51 68.61,119.53 | U$1.GND 85.7,114.5 J44.4 | C11.1 C10.1 v75.87,98.3 | C9.1 74.73,95.76 v75.62,94.87 | U2.COM2 66.87,95.52 v66.85,95.5 | U2.COM4 68.17,94.74 v68.1,94.67 67.52,95.25 U2.COM3 | R5.2 v140.72,42.7 | U2.COM1 v64.54,98.4
  Top 0.406: C8.1 61.62,99.82 v61.62,101.22 | 68.63,117.77 68.63,119.46 v68.61,119.48 68.66,119.53 | 74.07,119.53 68.66,119.53 | 68.66,119.53 68.61,119.53 66.34,119.53 66.06,119.25 65.02,119.25 R10.1
  Top 0.813: C3.1 v124.36,63.27
  Bottom 0.305: v75.87,98.3 76.3,98.3 | v75.62,94.87 75.62,94.84 75.79,94.67 | v66.85,95.5 66.85,95.48 66.88,95.45 | v68.1,94.67 68.1,94.54 67.97,94.41 | v140.72,42.7 140.72,42.16 140.66,42.11 | v64.54,98.4 64.36,98.22 64.36,97.77
  Bottom 0.406: v61.62,101.22 60.68,101.22 60.68,101.19 | v68.61,119.48 68.63,119.1 69.06,119.53
  Bottom 0.813: v124.36,63.27 124.38,63.3 126.85,63.3 126.9,63.25
  pour Bottom (isolate 0.305): 0.49,155.38 155.44,155.35 155.49,0.45 1,0.5
MICROPH  (via drill 0.5)
  Top 0.305: R9.1 76,118.57 v76.91,119.48 | v76.91,109.02 76.91,101.37 79.68,98.6 79.68,63.2 80.97,61.9 80.97,59.46 81.86,58.57 81.86,48.72 82.8,47.78 82.83,47.78 84.25,46.35 95.56,46.35 100.48,41.43 100.48,31.17 102.18,29.46 113.99,29.46 JP1.11 | A1.D3 27.34,58.19 39.14,58.19 40.95,56.39 | 40.95,56.39 40.95,48.97 | 40.95,56.39 40.92,56.36 40.92,48.95 43.79,46.08 54.84,46.08 60.05,40.87 60.05,32.31 63.07,29.29 68.2,29.29 72.52,24.97 85.67,24.97 85.98,24.66 v86,24.66
  Bottom 0.305: v76.91,119.48 v76.91,109.02 | v86,24.66 87.61,26.26 93.65,26.26 94.92,27.53 111.56,27.53 113.36,29.34 JP1.11
N$1
  Bottom 0.254: 130.35,17.91 136.7,17.91
  Bottom 0.305: J2.2 129.47,17.02 130.35,17.91 | 136.7,17.91 137.59,17.02 139.68,17.02 J1.3
N$2
  Bottom 0.254: J3.2 111.81,17 112.72,17.91 119.36,17.91 120.24,17.02 J2.3
N$3
  Bottom 0.254: J4.2 103.64,17.03 J3.3
N$4
  Bottom 0.305: J5.3 52.23,17.02 J6.2
N$5
  Bottom 0.305: J6.3 J7.2
N$6
  Bottom 0.305: J7.3 16.28,16.99 J8.2
N$7
  Bottom 0.305: J4.3 70.25,17.03 J5.2
N$8
  Bottom 0.305: J9.3 J10.2
N$9
  Bottom 0.305: J10.3 J11.2
N$10
  Bottom 0.305: J11.3 88.27,35.01 J12.2
N$11
  Bottom 0.305: J13.3 52.26,35.02 J14.2
N$12
  Bottom 0.305: J14.3 34.25,35 J15.2
N$13
  Bottom 0.305: J15.3 28.62,34.97 28.3,34.65 18.11,34.65 17.8,34.95 16.29,34.95 J16.2
N$14
  Top 0.305: J12.3 78.3,34.99 77.11,36.17 72.85,36.17 71.73,35.05 70.27,35.05 J13.2
N$15
  Bottom 0.305: J17.3 J18.2
N$16
  Bottom 0.305: J18.3 106.4,53.01 J19.2
N$17
  Bottom 0.305: J19.3 88.29,52.93 J20.2
N$18
  Bottom 0.305: J21.3 52.33,52.98 J22.2
N$19
  Bottom 0.305: J22.3 34.33,52.91 J23.2
N$20
  Top 0.305: J23.3 29.23,53.02 28.32,53.92 19.41,53.92 18.41,52.93 16.29,52.93 J24.2
N$21
  Bottom 0.305: J20.3 82.17,53.01 79.93,50.77 73.99,50.77 72.16,52.6 70.61,52.6 J21.2
N$22
  Bottom 0.305: J25.3 124.27,71.04 J26.2
N$23
  Bottom 0.305: J26.3 J27.2
N$24
  Bottom 0.305: J27.3 J28.2
N$25
  Bottom 0.305: J29.3 J30.2
N$26
  Top 0.305: J30.3 J31.2
N$27
  Bottom 0.305: J31.3 16.27,71.03 J32.2
N$28
  Bottom 0.305: J28.3 70.25,71.02 J29.2
N$29  (via drill 0.5)
  Top 0.305: v146.23,19.71 146.23,33.6 144.82,35.01 J9.2
  Bottom 0.305: J8.3 10.65,16.98 9.22,15.54 9.22,14.25 11.38,12.09 111.81,12.09 112.55,12.83 144.7,12.83 146.23,14.35 v146.23,19.71 | 142.3,35.08 J9.2
N$30
  Bottom 0.305: J16.3 12.86,34.97 11.79,36.04 11.79,44.37 13.16,45.74 69.6,45.74 73.71,49.86 81.31,49.86 82.86,48.31 144.3,48.31 146.05,50.06 146.05,52.43 145.39,53.09 142.3,53.09 J17.2
N$31  (via drill 0.5)
  Top 0.305: v37.57,67.18 37.62,67.23 52.98,67.23 53.11,67.11 v55.63,67.11
  Bottom 0.305: J24.3 12.01,52.97 11,53.98 11,65.61 12.57,67.18 v37.57,67.18 | J25.2 142.38,70.89 145.9,70.89 146.35,70.43 146.35,68.45 144.93,67.03 65.35,67.03 63.37,69.01 57.53,69.01 57.12,68.61 v55.63,67.11
N$32
  Top 0.305: C7.1 65,114.67 R7.2 67.22,114.69 IC1.4
N$33
  Bottom 0.305: J33.3 J34.2
N$34
  Bottom 0.305: J34.3 J35.2
N$35
  Bottom 0.305: J35.3 J36.2
N$36
  Bottom 0.305: J37.3 52.34,89 J38.2
N$37
  Bottom 0.305: J38.3 34.26,88.98 J39.2
N$38
  Bottom 0.305: J39.3 16.29,89 J40.2
N$39
  Bottom 0.305: J36.3 70.29,89.03 J37.2
N$40
  Bottom 0.305: J41.3 124.29,107 J42.2
N$41
  Bottom 0.305: J42.3 J43.2
N$42
  Bottom 0.305: J43.3 88.26,107.03 J44.2
N$43
  Bottom 0.305: J45.3 52.34,107.03 J46.2
N$44
  Top 0.305: J46.3 34.29,106.98 J47.2
N$45
  Bottom 0.305: J47.3 16.36,107.03 J48.2
N$46
  Bottom 0.305: J44.3 70.26,107 J45.2
N$47
  Bottom 0.305: J49.3 124.36,125 J50.2
N$48
  Bottom 0.305: J50.3 106.36,124.92 J51.2
N$49
  Bottom 0.305: J51.3 88.26,124.98 J52.2
N$50
  Bottom 0.305: J53.3 52.29,124.98 J54.2
N$51
  Top 0.305: J54.3 34.26,125.03 J55.2
N$52
  Top 0.305: J55.3 16.34,125 J56.2
N$53
  Bottom 0.305: J52.3 70.26,125 J53.2
N$54
  Top 0.305: J58.2 J57.3
N$55
  Top 0.305: J59.2 106.24,143 J58.3
N$56
  Top 0.305: J60.2 J59.3
N$57
  Top 0.305: J62.2 J61.3
N$58
  Top 0.305: J63.2 34.29,142.93 J62.3
N$59
  Top 0.305: J64.2 16.34,142.98 J63.3
N$60
  Top 0.305: J61.2 70.42,143.03 J60.3
N$61
  Bottom 0.305: J40.3 12.42,88.98 11.58,89.81 11.58,101.22 13.41,103.05 144.2,103.05 145.36,104.22 145.36,106.3 144.7,106.96 142.25,106.96 J41.2
N$62
  Bottom 0.305: J48.3 12.66,106.92 11.46,108.13 11.46,119.08 13.06,120.67 58.57,120.67 59.23,121.34 65.02,121.34 65.68,120.67 144.96,120.67 146.33,122.05 146.33,124.16 145.44,125.04 142.28,125.04 J49.2
N$63
  Top 0.305: J57.2 142.24,143.03 145.11,143.03 146,142.14 146,139.95 145.24,139.19 12.37,139.19 10.67,137.49 10.67,126.21 11.96,124.92 J56.3
N$64
  Bottom 0.305: J32.3 12.74,71 11.68,72.06 11.68,83.03 13.41,84.76 144.5,84.76 146.05,86.31 146.05,88.14 145.01,89.18 142.39,89.18 J33.2
N$65
  Top 0.305: R4.1 142.8,42.16 142.29,41.66 137.54,41.66 136.75,42.44 U1.1 136.68,44.17 134.65,46.2 116.15,46.2 114.22,48.13
  Top 1.27: R3.2 114.22,48.13 116.28,50.18 FDD6637.2
N$66
  Top 0.305: R7.1 65,116.23 R10.2 67.58,117.71 IC1.3
N$67  (via drill 0.5)
  Top 0.305: R4.2 R5.1 137.77,46.08 U1.3 135.64,46.2 134.06,47.78 v134.06,49.76 | FDD6637.1 111.72,51.31 v111.66,51.26
  Bottom 0.305: v111.66,51.26 111.68,51.26 113.18,49.76 v134.06,49.76
N$68
  Top 0.305: C5.1 74.31,116.8 R9.2 76,114.28 Q3.1
N$69
  Top 0.305: IC1.1 70.95,117.69 71.5,118.24 72.49,118.24 R8.2
N$70
  Top 0.305: R8.1 72.51,113.4 73.7,112.2 Q3.3 76.46,112.2 77.72,113.46 77.72,117.32 78.69,118.29 79.52,118.29 C6.2
N$72
  Top 0.305: R13.1 79.63,116.78 C6.1 79.6,116.81 U$1.IN
SOUND  (via drill 0.51)
  Top 0.305: A1.A0 78.59,52.67 79.48,51.79 79.48,47.45 82.93,43.99 94.23,43.99 97.89,40.34 97.89,25.86 v98.4,25.35 | v61.92,66.88 61.92,97.28 60.43,98.78 60.43,102.29 60.4,102.31 60.4,114.28 62.33,116.2 C7.2 R11.1 62.47,117.72 60.91,119.28 60.35,119.28 R12.2
  Bottom 0.305: v98.4,25.35 99.92,26.87 114.04,26.87 JP1.10 | A1.A0 74.5,52.67 73.33,53.85 73.33,58.5 68.81,63.02 64.26,63.02 61.92,65.35 v61.92,66.88
SWITCH  (1 unrouted)
  Top 0.305: 96.19,9.91 96.19,16.48 91.24,21.44 88.9,21.44 87.55,22.78 R6.2 87.3,23.62 85.72,23.62 84.94,24.41 72.31,24.41 68,28.73 62.79,28.73 59.49,32.03 59.49,40.62 54.59,45.52 43.59,45.52 40.39,48.72 40.39,56.21 38.94,57.66 29.46,57.66 27.02,55.22 A1.D4 | 96.19,9.91 96.19,3.43 96.11,3.5 | JP2.10 129.9,26.8 129.08,25.98 129.08,13.61 117.32,1.85 106.86,1.85 98.86,9.86 96.24,9.86 96.19,9.91 | 96.11,5.49 96.11,3.05 S1.2
  Bottom 0.305: JP2.10 131.88,26.75
V+  (via drill 0.5)  (2 unrouted)
  Top 0.305: v82.42,63.86 82.63,63.65 83.19,63.65
  Bottom 0.813: A1.A4 76.26,63.93 80.95,63.93 81.05,63.83 v83.67,63.83 | 83.72,65 82.53,65 82.5,65.02 82.5,63.86 | 83.77,63.78 83.77,64.92 83.69,65
  other vias: 82.47,65.05 83.62,65
  pour Top (isolate 0.305): 0.54,155.4 155.44,155.38 155.52,0.45 1,0.5
XOUT  (via drill 0.5, 0.51)
  Top 0.305: v100.41,25.17 98.53,27.05 98.53,40.62 94.59,44.55 83.24,44.55 80.06,47.73 80.06,53.87 78.72,55.22 A1.A1 | U2.X 69.6,99.69 71.32,99.69 71.42,99.8 C11.2 72.95,99.87 72.95,100.61 73.38,101.04 75.82,101.04 78.79,98.07 78.79,63.02 79.35,62.46 v79.35,61.16
  Bottom 0.305: v100.41,25.17 100.41,25.22 101.37,26.19 109.09,26.19 111,24.28 114.09,24.28 JP1.9 | A1.A1 76.07,55.22 79.35,58.5 v79.35,61.16
YOUT  (via drill 0.5, 0.51)
  Top 0.305: v102.51,24.97 99.24,28.25 99.24,40.77 94.87,45.14 83.62,45.14 83.46,45.29 83.46,45.31 80.59,48.18 80.59,56.54 79.4,57.73 75.18,57.73 A1.A2 | U2.Y 70.89,98.4 70.99,98.3 C10.2 72.87,97.41 73.28,97 75.92,97 78.13,94.79 v78.13,62.13
  Bottom 0.305: v102.51,24.97 107.62,24.97 110.77,21.82 114.02,21.82 JP1.8 | v78.13,62.13 78.16,62.1 78.16,59.23 76.68,57.76 A1.A2
ZOUT
  Top 0.305: 99.85,41.12 95.25,45.72 84.02,45.72 81.23,48.51 81.23,57.91 79.76,59.38 76.07,59.38 A1.A3 75.48,60.3 76.91,61.72 76.91,62.48 77.5,63.07 77.5,90.73 72.82,95.4 72.87,95.45 C9.2 70.69,95.76 70.03,95.1 69.34,95.1 68.81,95.63 68.81,96.98 U2.Z | 99.85,41.12 99.9,41.07 | JP1.7 112.75,20.55 110.8,20.55 107.72,23.62 105.49,23.62 99.85,29.26 99.85,41.12

### Text on the board
bPlace: www.lytelab.com | GND | DIN | +5V | Arduino | Spark Core | Offline/Online Switch